# Altium project 7841R_AIO.PrjPcb
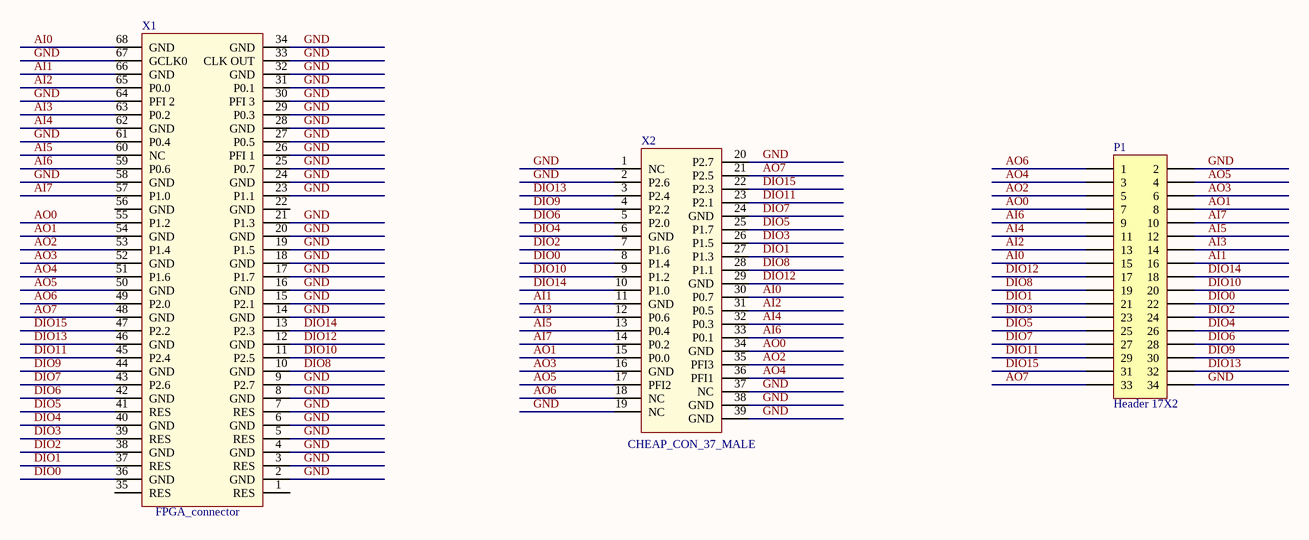
[diagram p0: Sheet1_7841_AIO.SchDoc]
1 sheet, 3 parts. Net scope: global (net labels, ports and power ports of the same name join across sheets).
Board file: PCB1_7841_AIO.PcbDoc

## Sheet Sheet1_7841_AIO.SchDoc
size A3; SheetNumber: 1; SheetTotal: 1

### Parts
P1  Header 17X2  [HDR2X17]
X1  FPGA_connector  [FPGA]
X2  CHEAP_CON_37_MALE  [CHEAP_CONN_MALE]

### Nets
AI0: P1.15 X1.68(GND) X2.30(P0.7)
AI1: P1.16 X1.66(GND) X2.11(GND)
AI2: P1.13 X1.65(P0.0) X2.31(P0.5)
AI3: P1.14 X1.63(P0.2) X2.12(P0.6)
AI4: P1.11 X1.62(GND) X2.32(P0.3)
AI5: P1.12 X1.60(NC) X2.13(P0.4)
AI6: P1.9 X1.59(P0.6) X2.33(P0.1)
AI7: P1.10 X1.57(P1.0) X2.14(P0.2)
AO0: P1.7 X1.55(P1.2) X2.34(GND)
AO1: P1.8 X1.54(GND) X2.15(P0.0)
AO2: P1.5 X1.53(P1.4) X2.35(PFI3)
AO3: P1.6 X1.52(GND) X2.16(GND)
AO4: P1.3 X1.51(P1.6) X2.36(PFI1)
AO5: P1.4 X1.50(GND) X2.17(PFI2)
AO6: P1.1 X1.49(P2.0) X2.18(NC)
AO7: P1.33 X1.48(GND) X2.21(P2.5)
DIO0: P1.22 X1.36(GND) X2.8(P1.4)
DIO1: P1.21 X1.37(RES) X2.27(P1.3)
DIO2: P1.24 X1.38(GND) X2.7(P1.6)
DIO3: P1.23 X1.39(RES) X2.26(P1.5)
DIO4: P1.26 X1.40(GND) X2.6(GND)
DIO5: P1.25 X1.41(RES) X2.25(P1.7)
DIO6: P1.28 X1.42(GND) X2.5(P2.0)
DIO7: P1.27 X1.43(P2.6) X2.24(GND)
DIO8: P1.19 X1.10(GND) X2.28(P1.1)
DIO9: P1.30 X1.44(GND) X2.4(P2.2)
DIO10: P1.20 X1.11(P2.5) X2.9(P1.2)
DIO11: P1.29 X1.45(P2.4) X2.23(P2.1)
DIO12: P1.17 X1.12(GND) X2.29(GND)
DIO13: P1.32 X1.46(GND) X2.3(P2.4)
DIO14: P1.18 X1.13(P2.3) X2.10(P1.0)
DIO15: P1.31 X1.47(P2.2) X2.22(P2.3)
GND: P1.2 P1.34 X1.2(GND) X1.3(RES) X1.4(GND) X1.5(RES) X1.6(GND) X1.7(RES) X1.8(GND) X1.9(P2.7) X1.14(GND) X1.15(P2.1) X1.16(GND) X1.17(P1.7) X1.18(GND) X1.19(P1.5) X1.20(GND) X1.21(P1.3) X1.23(P1.1) X1.24(GND) X1.25(P0.7) X1.26(PFI_1) X1.27(P0.5) X1.28(GND) X1.29(P0.3) X1.30(PFI_3) X1.31(P0.1) X1.32(GND) X1.33(CLK_OUT) X1.34(GND) X1.58(GND) X1.61(P0.4) X1.64(PFI_2) X1.67(GCLK0) X2.1(NC) X2.2(P2.6) X2.19(NC) X2.20(P2.7) X2.37(NC) X2.38(GND) X2.39(GND)

Not connected (* = marked no-connect by the designer): X1 1(RES) 22(GND) 35(RES) 56(GND)

### Library data of the parts
P1 = Header 17X2: Header, 17-Pin, Dual row; LatestRevisionDate: 17-Jul-2002; LatestRevisionNote: Re-released for DXP Platform.; Publisher: Altium Limited